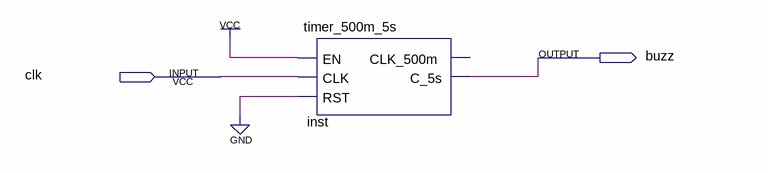
[diagram p0: schematic sheet]
// Quartus schematic test.bdf as structural Verilog: 1 symbols, 2 pins
module test (
  input  clk,
  output buzz
);

  timer_500m_5s inst (.EN(1'b1), .CLK(clk), .RST(1'b0), .C_5s(buzz));  // open: CLK_500m
endmodule
